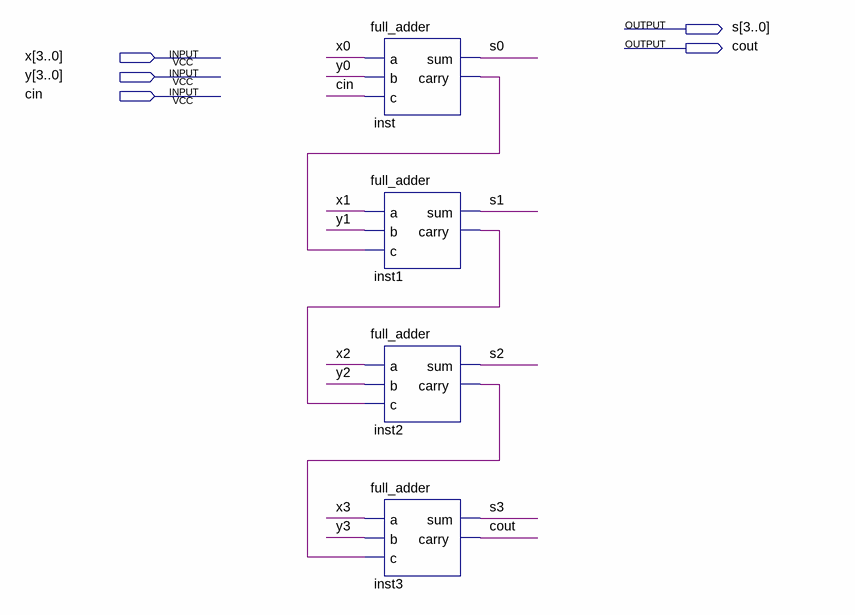
[diagram p0: schematic sheet]
// Quartus schematic somador4bits.bdf as structural Verilog: 4 symbols, 5 pins
module somador4bits (
  input  [3:0] x,
  input  [3:0] y,
  input  cin,
  output [3:0] s,
  output cout
);

  wire inst1_carry, inst2_carry, inst_carry;

  full_adder inst (.a(x[0]), .b(y[0]), .c(cin), .sum(s[0]), .carry(inst_carry));
  full_adder inst1 (.a(x[1]), .b(y[1]), .c(inst_carry), .sum(s[1]), .carry(inst1_carry));
  full_adder inst2 (.a(x[2]), .b(y[2]), .c(inst1_carry), .sum(s[2]), .carry(inst2_carry));
  full_adder inst3 (.a(x[3]), .b(y[3]), .c(inst2_carry), .sum(s[3]), .carry(cout));
endmodule
